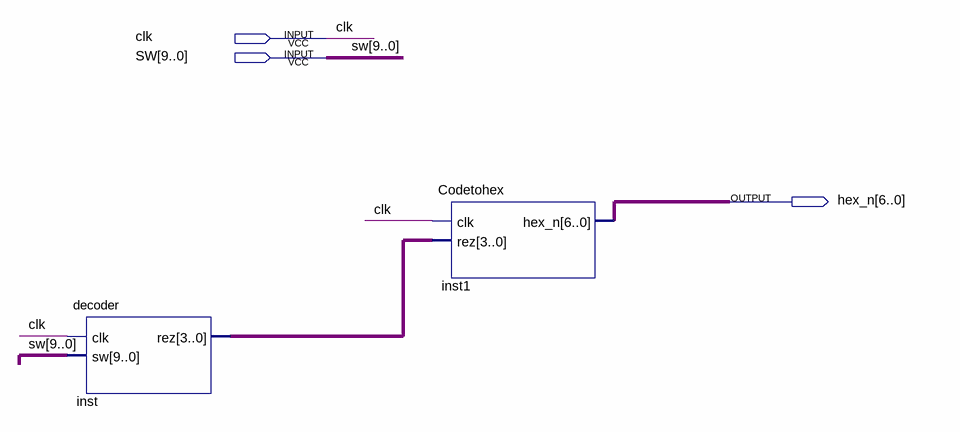
[diagram p0: schematic sheet]
// Quartus schematic Block1.bdf as structural Verilog: 2 symbols, 3 pins
module Block1 (
  input  clk,
  input  [9:0] SW,
  output [6:0] hex_n
);

  wire [3:0] inst_rez;

  decoder inst (.clk(clk), .sw(SW), .rez(inst_rez));
  Codetohex inst1 (.clk(clk), .rez(inst_rez), .hex_n(hex_n));
endmodule
